# Altium schematic sheet pc2micro.SchDoc
size A
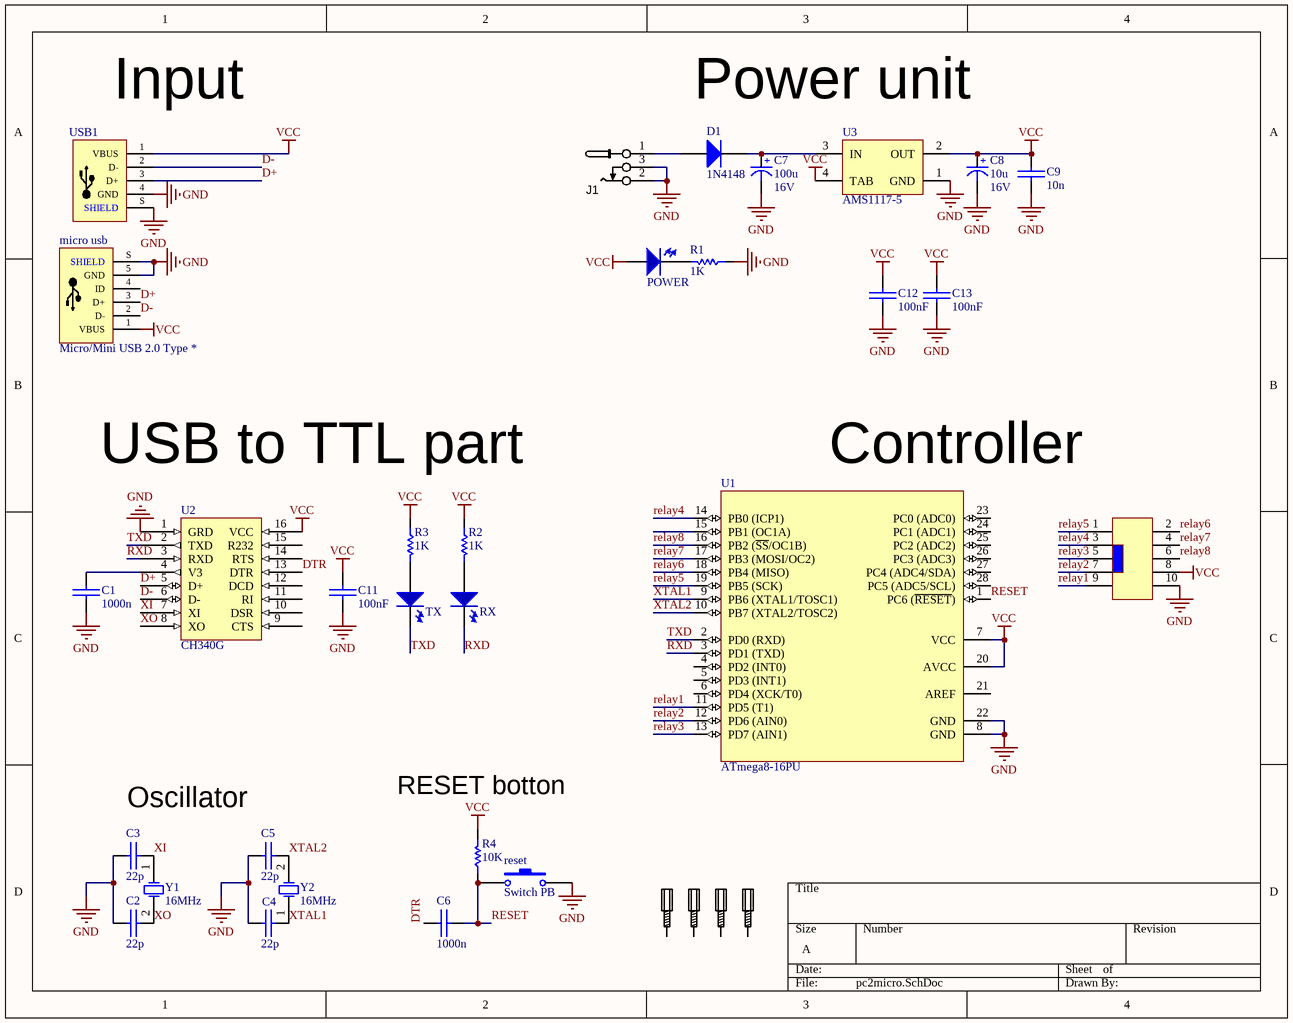
[diagram p0: pc2micro.SchDoc]

## Parts
C1  1000n  [Cap - 100nF]
C2  22p  [Cap - 100nF]
C3  22p  [Cap - 100nF]
C4  22p  [Cap - 100nF]
C5  22p  [Cap - 100nF]
C6  1000n  [Cap - 100nF]
C7  Voltage: 16V  [cap 01]  (hidden comment: 100u)
C8  Voltage: 16V  [cap 01]  (hidden comment: 10u)
C9  10n  [Cap - 100nF]
C11  100nF  [Cap - 100nF]
C12  100nF  [Cap - 100nF]
C13  100nF  [Cap - 100nF]
D1  1N4148  [DO-35]
IDC1  DC3-10  [DC3-2.54-10]  (value not drawn)
J1  CONN_PWR_JACK_2.1x5.5mm  [CONN_PWR_JACK_v2]  (value not drawn)
MECH1  # pcs.  [PCB_standoff]  (value not drawn)
MECH2  # pcs.  [PCB_standoff]  (value not drawn)
MECH3  # pcs.  [PCB_standoff]  (value not drawn)
MECH4  # pcs.  [PCB_standoff]  (value not drawn)
micro_usb  Micro/Mini USB 2.0 Type *  [Micro_USB2_0_B_SMT_DIP2_1]
POWER  SMD LED  [LED 5mm]  (value not drawn)
R1  1K  [Res-(1/4)]
R2  1K  [Res-(1/4)]
R3  1K  [Res-(1/4)]
R4  10K  [Res-(1/4)]
reset  Switch PB  [Switch - Push to On]
RX  SMD LED  [LED 5mm]  (value not drawn)
TX  SMD LED  [LED 5mm]  (value not drawn)
U1  ATmega8-16PU  [28P3]
U2  CH340G  [SOP-16]
U3  AMS1117-5  [MP04A_N]
USB1  USB 2.0 Type *  [USB2_0_A_DIP]  (value not drawn)
Y1  16MHz  [XTAL Small]
Y2  16MHz  [XTAL Small]

## Nets
GND: C1.2(-) C2.1(+) C3.1(+) C4.1(+) C5.1(+) C7.2(-) C8.2(-) C9.1(+) C11.2(-) C12.2(-) C13.2(-) IDC1.10 J1.2 J1.3 micro_usb.5(GND) micro_usb.S(SHIELD) R1.1 reset.2 U1.8(GND) U1.22(GND) U2.1(GRD) U3.1(GND) USB1.4(GND) USB1.S(SHIELD)
VCC: C8.1(+) C9.2(-) C11.1(+) C12.1(+) C13.1(+) IDC1.8 micro_usb.1(VBUS) POWER.1(A) R2.1 R3.1 R4.2 U1.7(VCC) U1.20(AVCC) U2.16(VCC) U3.2(OUT) U3.4(TAB) USB1.1(VBUS)
D+: micro_usb.3(D+) U2.5(D+) USB1.3(D+)
D-: micro_usb.2(D-) U2.6(D-) USB1.2(D-)
DTR: C6.1(+) U2.13(DTR)
relay1: IDC1.9 U1.11(PD5_(T1))
relay2: IDC1.7 U1.12(PD6_(AIN0))
relay3: IDC1.5 U1.13(PD7_(AIN1))
relay4: IDC1.3 U1.14(PB0_(ICP1))
relay5: IDC1.1 U1.19(PB5_(SCK))
relay6: IDC1.2 U1.18(PB4_(MISO))
relay7: IDC1.4 U1.17(PB3_(MOSI/OC2))
relay8: IDC1.6 U1.16(PB2_(~{SS}/OC1B))
RESET: C6.2(-) R4.1 reset.1 U1.1(PC6_(~{RESET}))
RXD: RX.2(K) U1.3(PD1_(TXD)) U2.3(RXD)
TXD: TX.2(K) U1.2(PD0_(RXD)) U2.2(TXD)
XI: C3.2(-) U2.7(XI) Y1.1(OSC1)
XO: C2.2(-) U2.8(XO) Y1.2(OSC2)
XTAL1: C4.2(-) U1.9(PB6_(XTAL1/TOSC1)) Y2.1(OSC1)
XTAL2: C5.2(-) U1.10(PB7_(XTAL2/TOSC2)) Y2.2(OSC2)
NetC1_1: C1.1(+) U2.4(V3)
NetC7_1: C7.1(+) D1.2(K) U3.3(IN)
NetD1_1: D1.1(A) J1.1
NetPOWER_2: POWER.2(K) R1.2
NetR2_2: R2.2 RX.1(A)
NetR3_2: R3.2 TX.1(A)

Not connected (* = marked no-connect by the designer): MECH1 MH1; MECH2 MH1; MECH3 MH1; MECH4 MH1; micro_usb 4(ID); U1 4(PD2_(INT0)) 5(PD3_(INT1)) 6(PD4_(XCK/T0)) 15(PB1_(OC1A)) 21(AREF) 23(PC0_(ADC0)) 24(PC1_(ADC1)) 25(PC2_(ADC2)) 26(PC3_(ADC3)) 27(PC4_(ADC4/SDA)) 28(PC5_(ADC5/SCL)); U2 9(CTS) 10(DSR) 11(RI) 12(DCD) 14(RTS) 15(R232)

## Notes on the sheet
- (near USB1) Input
- Power unit
- USB to TTL part
- Controller
- Oscillator
- (near R4) RESET botton

## Library data of the parts
C1-C6 C9 C11-C13 = Cap-Bipolar: Bipolar Capacitor; Voltage: 100V; Designer: Saeid Jorablo; Organazation: ControTec; Adding Date: 1387/12/20
  C1 C6: Value: 1000n
  C2-C5: Value: 22p
  C9: Value: 10n
  C11-C13: Value: 100nF
C7 C8 = Cap-Polar: Polar Capacitor; Designer: Saeid Jorablo; Organazation: ControTec; Adding Date: 1387/12/20
  C7: Value: 100u
  C8: Value: 10u
D1 = Diode 1N4148: High Conductance Fast Diode; Published: 8-Jun-2000; LatestRevisionDate: 17-Jul-2002; LatestRevisionNote: Re-released for DXP Platform.; DatasheetVersion: 1997; PackageReference: DO-35; Publisher: Altium Limited; PackageDescription: Diode, Axial; Body 3.8 x 1.9 mm (LxDia. max), Lead Dia. 0.53 mm (max); Code_JEDEC: DO-204-AH; ComponentLink1Description: Manufacturer Link; ComponentLink1URL: http://www.fairchildsemi.com/; ComponentLink2Description: Datasheet; ComponentLink2URL: http://www.fairchildsemi.com/ds/1N%2F1N4148.pdf
IDC1 = DC3-10: 简易牛角座, 10pins
J1 = CONN_PWR_JACK_2.1x5.5mm: Power Connector, THT, 2.1mm ID, 5.5mm OD; Manufacturer Part Number 1: PJ-031DH; Manufacturer: CUI Inc.; Part Description: CON PWR JCK 1.3 X 4.2MM HIGH CUR; Internal Switch(s): Single Switch, Normally Closed; Current Rating: 3.5A; Connector Type: Jack; Gender: Male; Shielding: Unshielded; Voltage - Rated: 16VDC; Plug/Mating Plug Diameter: 1.35mm ID, 3.5mm OD; Number of Positions/Contacts: 2 Conductors, 3 Contacts; Supplier 1: Digi-Key; Supplier Part Number 1: CP-031DH-ND; Operating Temperature: -25°C ~ 85°C; Contact Material: Brass; RoHS: RoHS Compliant; Color: Black; Features: -; Housing Material: Thermoplastic; Housing Color: Black; Contact Material - Plating: Nickel; Mounting Type: Through Hole, Right Angle; Termination: Solder; Category: Connectors, Interconnects
MECH1-MECH4 = STANDOFF_M-F_THREADED_M3x8x10mm_HEX_5mm dia: STANDOFF M/F MET 5MM HEX 10MM L; Manufacturer: FIX&FASTEN; Manufacturer Part Number 1: FIX-MAE-5TV; Part Description: PCB distance; polyamide; L:5mm; Colour: natural; Øcutout:3mm; Unit: pcs; SuppliedAmount: 1000; MinAmount: 10; Type of spacer: PCB distance; Panel cutout diameter: 3mm; Spanner size: 5.5mm; Internal thread: M3; Thread pitch: 0,5; Supplier 1: TME; Supplier Part Number 1: FIX-MAE-5TV; Category: Plastic Pegs; Weight: 0.145; Multiples: 10; Material: polyamide; Spacer length: 5mm; Price Type: NET
micro_usb = USB2_0-Micro&Mini: Micro and Mini USB 2.0 (Type A and Type A/B)
POWER RX TX = LED SMD
R1-R4 = Resistor: Tolerance: 5%; Power: 1/8 W
  R1-R3: Value: 1K
  R4: Value: 10K
reset = Switch PB: Push Button Switch
U1 = ATmega8-16PU: 8-bit AVR Microcontroller, 4.5-5.5V, 16MHz, 8KB Flash, 512 Bytes EEPROM, 1KB SRAM, 28-pin PDIP, Industrial Grade (-40°C to 85°C); DatasheetVersion: revZ, Feb-2011; PackageVersion: revB, Sep-2001; PackageReference: 28P3; PackageDescription: 28-lead (0.300"/7.62mm Wide) Plastic Dual Inline Package (PDIP); ComponentLink1Description: Manufacturer URL; ComponentLink1URL: http://www.atmel.com/; ComponentLink2Description: ATmega8(L); ComponentLink2URL: http://www.atmel.com/dyn/resources/prod_documents/doc2486.pdf; ComponentLink3Description: ATmega8(L) Summary; ComponentLink3URL: http://www.atmel.com/dyn/resources/prod_documents/2486S.pdf
U3 = LM1117IMP-5.0: x.x Volt, 800mA Low-Dropout Linear Regulator, 4-pin SOT-223; PartNumber: LM1117IMP-3.3; Manufacturer: National Semiconductor; PackageTopMarking: XYTT*N05B; PowerWise: N; CompType: LDO IC; Published: 4-Dec-2008; DatasheetVersion: Apr-2006; PackageVersion: revB, Apr-2003; PackageReference: MP04A; Publisher: Altium Limited; PackageDescription: Molded SOT-223, 6.50 x 3.56 x 1.6mm Body, 4 Lead, 2.3mm Pitch; Supplier 1: Farnell; Supplier Part Number 1: 7614123; RoHS: N; PinCount: 4; Code_JEDEC: TO-261-AA; Code_IPC: SOT223-4; ComponentLink1Description: LM1117 Datasheet; ComponentLink1URL: http://www.national.com/ds/LM/LM1117.pdf; ComponentLink2Description: LM1117 Web Page; ComponentLink2URL: http://www.national.com/pf/LM/LM1117.html; ComponentLink3Description: MP04A Package Page; ComponentLink3URL: http://www.national.com/packaging/folders/mp04a.html
USB1 = USB2_0-A&B: USB 2.0 Type A and Type B; Part Number: 61400413321; Interface Type: USB 2.0 Type B; Rated Current: 1.5 A; Gender: Female; ComponentLink1Description: Manufacturer; ComponentLink1URL: http://www.we-online.de; ComponentLink2Description: Datasheet; ComponentLink2URL: http://katalog.we-online.de/em/datasheet/61400413321.pdf; Published Date: May 2018; Publisher: Wurth Elektronik; Orientation: Vertical; Operating Temperature: -40 to 105 degC; Mounting Technology: THT; Packaging: Tray
Y1 Y2 = XTAL: XTAL Crystal; Company: E.P.I.L; Design Date: 11/04/2011; Value: 16MHz